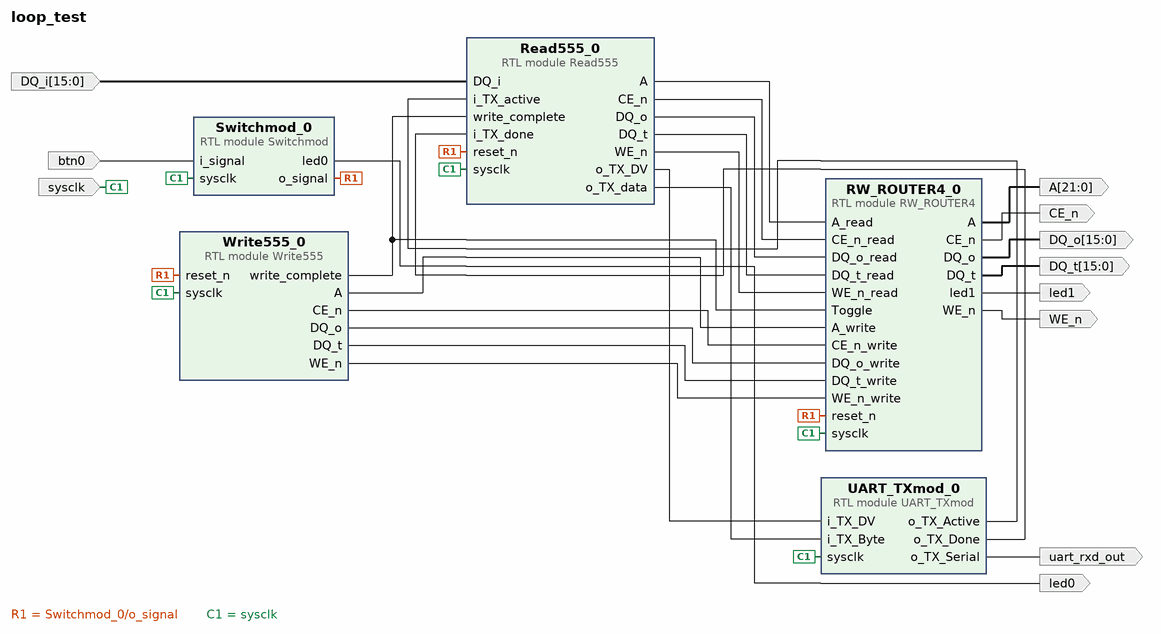
[diagram p0: block diagram of the top level]
# Vivado block design loop_test, xc7a35tcpg236-1, Vivado 2024.2
create_bd_design loop_test

create_bd_port -dir I sysclk
create_bd_port -dir I btn0
create_bd_port -dir O led0
create_bd_port -dir I -from 15 -to 0 DQ_i
create_bd_port -dir O uart_rxd_out
create_bd_port -dir O led1
create_bd_port -dir O -from 21 -to 0 A
create_bd_port -dir O CE_n
create_bd_port -dir O WE_n
create_bd_port -dir O -from 15 -to 0 DQ_o
create_bd_port -dir O -from 15 -to 0 DQ_t

create_bd_cell -type module -reference RW_ROUTER4 RW_ROUTER4_0
create_bd_cell -type module -reference Switchmod Switchmod_0
create_bd_cell -type module -reference UART_TXmod UART_TXmod_0
create_bd_cell -type module -reference Read555 Read555_0
create_bd_cell -type module -reference Write555 Write555_0

# ---- connections ----

connect_bd_net [get_bd_ports DQ_i] [get_bd_pins Read555_0/DQ_i]
connect_bd_net [get_bd_pins RW_ROUTER4_0/A] [get_bd_ports A]
connect_bd_net [get_bd_pins RW_ROUTER4_0/CE_n] [get_bd_ports CE_n]
connect_bd_net [get_bd_pins RW_ROUTER4_0/DQ_o] [get_bd_ports DQ_o]
connect_bd_net [get_bd_pins RW_ROUTER4_0/DQ_t] [get_bd_ports DQ_t]
connect_bd_net [get_bd_pins RW_ROUTER4_0/WE_n] [get_bd_ports WE_n]
connect_bd_net [get_bd_pins RW_ROUTER4_0/led1] [get_bd_ports led1]
connect_bd_net [get_bd_pins Read555_0/A] [get_bd_pins RW_ROUTER4_0/A_read]
connect_bd_net [get_bd_pins Read555_0/CE_n] [get_bd_pins RW_ROUTER4_0/CE_n_read]
connect_bd_net [get_bd_pins Read555_0/DQ_o] [get_bd_pins RW_ROUTER4_0/DQ_o_read]
connect_bd_net [get_bd_pins Read555_0/DQ_t] [get_bd_pins RW_ROUTER4_0/DQ_t_read]
connect_bd_net [get_bd_pins Read555_0/WE_n] [get_bd_pins RW_ROUTER4_0/WE_n_read]
connect_bd_net [get_bd_pins Read555_0/o_TX_DV] [get_bd_pins UART_TXmod_0/i_TX_DV]
connect_bd_net [get_bd_pins Read555_0/o_TX_data] [get_bd_pins UART_TXmod_0/i_TX_Byte]
connect_bd_net [get_bd_pins Switchmod_0/led0] [get_bd_ports led0]
connect_bd_net [get_bd_pins Switchmod_0/o_signal] [get_bd_pins RW_ROUTER4_0/reset_n] [get_bd_pins Write555_0/reset_n] [get_bd_pins Read555_0/reset_n]
connect_bd_net [get_bd_pins UART_TXmod_0/o_TX_Active] [get_bd_pins Read555_0/i_TX_active]
connect_bd_net [get_bd_pins UART_TXmod_0/o_TX_Done] [get_bd_pins Read555_0/i_TX_done]
connect_bd_net [get_bd_pins UART_TXmod_0/o_TX_Serial] [get_bd_ports uart_rxd_out]
connect_bd_net [get_bd_pins Write555_0/A] [get_bd_pins RW_ROUTER4_0/A_write]
connect_bd_net [get_bd_pins Write555_0/CE_n] [get_bd_pins RW_ROUTER4_0/CE_n_write]
connect_bd_net [get_bd_pins Write555_0/DQ_o] [get_bd_pins RW_ROUTER4_0/DQ_o_write]
connect_bd_net [get_bd_pins Write555_0/DQ_t] [get_bd_pins RW_ROUTER4_0/DQ_t_write]
connect_bd_net [get_bd_pins Write555_0/WE_n] [get_bd_pins RW_ROUTER4_0/WE_n_write]
connect_bd_net [get_bd_pins Write555_0/write_complete] [get_bd_pins RW_ROUTER4_0/Toggle] [get_bd_pins Read555_0/write_complete]
connect_bd_net -net i_signal_0_1 [get_bd_ports btn0] [get_bd_pins Switchmod_0/i_signal]
connect_bd_net -net sysclk_0_1 [get_bd_ports sysclk] \
  [get_bd_pins Switchmod_0/sysclk] [get_bd_pins RW_ROUTER4_0/sysclk] [get_bd_pins UART_TXmod_0/sysclk] \
  [get_bd_pins Write555_0/sysclk] [get_bd_pins Read555_0/sysclk]

validate_bd_design
save_bd_design
